# Altium schematic sheet WIFI.SchDoc
size A; SheetNumber: 7; SheetTotal: 9
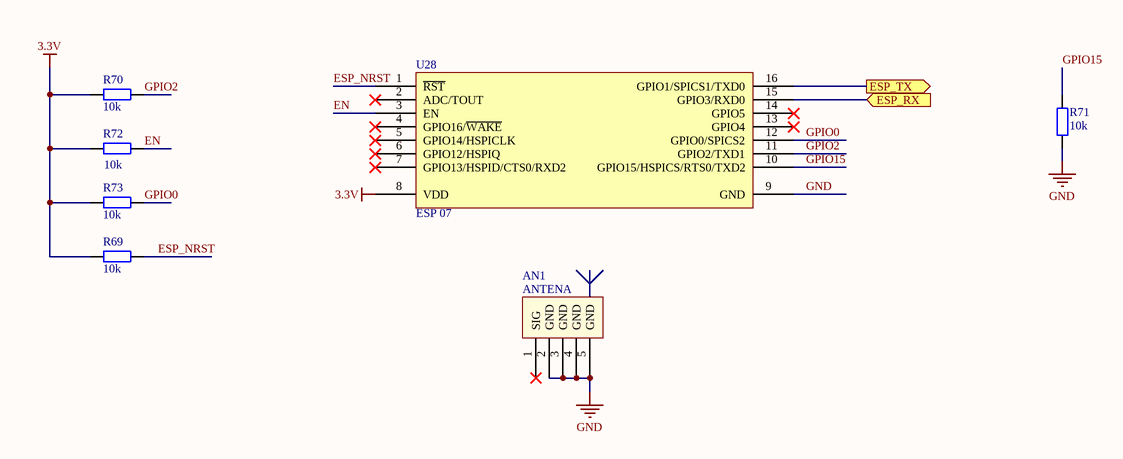
[diagram p0: WIFI.SchDoc]

## Parts
AN1  ANTENA  [DE ANTEN SMA CONG]
R69  10k  [tro smd 0805]
R70  10k  [tro smd 0805]
R71  10k  [tro smd 0805]
R72  10k  [tro smd 0805]
R73  10k  [tro smd 0805]
U28  ESP 07  [ESP8266 07]

## Ports
ESP_RX (in), ESP_TX (out)

## Nets
3.3V: R69.1 R70.2 R72.2 R73.2 U28.8(VDD)
GND: AN1.2(GND) AN1.3(GND) AN1.4(GND) AN1.5(GND) R71.1 U28.9(GND)
EN: R72.1 U28.3(EN)
ESP_NRST: R69.2 U28.1(~{RST})
ESP_RX: U28.15(GPIO3/RXD0) ; port ESP_RX
ESP_TX: U28.16(GPIO1/SPICS1/TXD0) ; port ESP_TX
GPIO0: R73.1 U28.12(GPIO0/SPICS2)
GPIO2: R70.1 U28.11(GPIO2/TXD1)
GPIO15: R71.2 U28.10(GPIO15/HSPICS/RTS0/TXD2)

Not connected (* = marked no-connect by the designer): AN1 1(SIG)*; U28 2(ADC/TOUT)* 4(GPIO16/~{WAKE})* 5(GPIO14/HSPICLK)* 6(GPIO12/HSPIQ)* 7(GPIO13/HSPID/CTS0/RXD2)* 13(GPIO4)* 14(GPIO5)*

## Library data of the parts
AN1 = ANTEN SMA CONG: Generic Antenna
R69-R73 = Tro 0805 1% 10k: Dán; Don_Vi: Con; So_Chan: 2; Ten_Linh_Kien: Trở 0805 1% 10k; Ma_Hang: MH005473; Chung_Loai: Dán; Kieu_Chan: *
U28 = ESP8266 07: ESP8266 07 16 Pin; IC: ESP8266-EX; Vendor: Ai-thinker